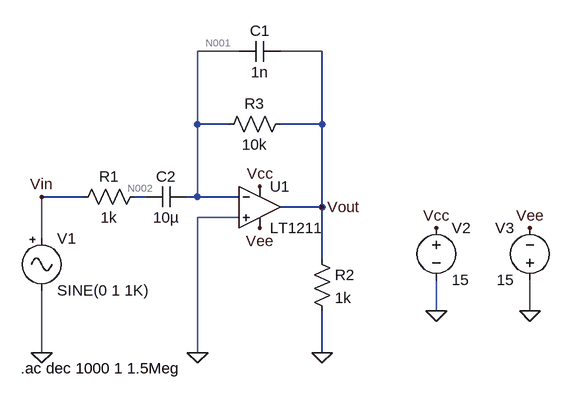
[diagram p0: schematic active_filter.asc]
active_filter.asc, the LTspice schematic file:
Version 4
SHEET 1 880 680
WIRE 336 -352 272 -352
WIRE 464 -352 400 -352
WIRE 272 -240 272 -352
WIRE 320 -240 272 -240
WIRE 464 -240 464 -352
WIRE 464 -240 400 -240
WIRE 96 -128 32 -128
WIRE 192 -128 176 -128
WIRE 272 -128 272 -240
WIRE 272 -128 256 -128
WIRE 336 -128 272 -128
WIRE 464 -112 464 -240
WIRE 464 -112 400 -112
WIRE 336 -96 272 -96
WIRE 32 -64 32 -128
WIRE 464 -32 464 -112
WIRE 640 48 640 0
WIRE 784 48 784 0
WIRE 32 112 32 16
WIRE 272 112 272 -96
WIRE 464 112 464 48
FLAG 32 112 0
FLAG 272 112 0
FLAG 464 112 0
FLAG 640 48 0
FLAG 784 48 0
FLAG 640 -80 Vcc
FLAG 368 -144 Vcc
FLAG 784 -80 Vee
FLAG 368 -80 Vee
FLAG 464 -112 Vout
FLAG 32 -128 Vin
SYMBOL res 192 -144 R90
WINDOW 0 0 56 VBottom 2
WINDOW 3 32 56 VTop 2
SYMATTR InstName R1
SYMATTR Value 1k
SYMBOL Misc\\signal 32 -80 R0
WINDOW 39 0 0 Left 0
SYMATTR InstName V1
SYMATTR Value2 AC 1
SYMBOL res 448 -48 R0
SYMATTR InstName R2
SYMATTR Value 1k
SYMBOL res 416 -256 R90
WINDOW 0 0 56 VBottom 2
WINDOW 3 32 56 VTop 2
SYMATTR InstName R3
SYMATTR Value 10k
SYMBOL cap 400 -368 R90
WINDOW 0 0 32 VBottom 2
WINDOW 3 32 32 VTop 2
SYMATTR InstName C1
SYMATTR Value 1n
SYMBOL voltage 640 -96 R0
WINDOW 123 0 0 Left 0
WINDOW 39 0 0 Left 0
SYMATTR InstName V2
SYMATTR Value 15
SYMBOL voltage 784 16 R180
WINDOW 0 24 96 Left 2
WINDOW 3 24 16 Left 2
WINDOW 123 0 0 Left 0
WINDOW 39 0 0 Left 0
SYMATTR InstName V3
SYMATTR Value 15
SYMBOL Opamps\\LT1211 368 -176 R0
SYMATTR InstName U1
SYMBOL cap 256 -144 R90
WINDOW 0 0 32 VBottom 2
WINDOW 3 32 32 VTop 2
SYMATTR InstName C2
SYMATTR Value 10µ
TEXT 0 136 Left 2 !.ac dec 1000 1 1.5Meg

The netlist it stands for:
* active_filter.asc
R1 N002 Vin 1k
V1 Vin 0 SINE(0 1 1K) AC 1
R2 Vout 0 1k
R3 Vout N001 10k
C1 Vout N001 1n
V2 Vcc 0 15
V3 0 Vee 15
XU1 0 N001 Vcc Vee Vout LT1211  ; pins In+ In- V+ V- OUT
C2 N001 N002 10µ
.ac dec 1000 1 1.5Meg
.lib LTC.lib
.backanno
.end

* Results of the author's LTspice run, read from the files saved beside the schematic
* Operating Point, zero values left out:
*   V(vout) = -500.2 µV
*   V(vcc) = 15 V
*   V(vee) = -15 V
*   I(R3) = -50.02 nA
*   I(R2) = -500.2 nA
*   I(V3) = -1.403 mA
*   I(V2) = -1.402 mA
*   Ix(u1:1) = -50.02 nA
*   Ix(u1:2) = -50.02 nA
*   Ix(u1:3) = 1.402 mA
*   Ix(u1:4) = -1.403 mA
*   Ix(u1:5) = 550.2 nA
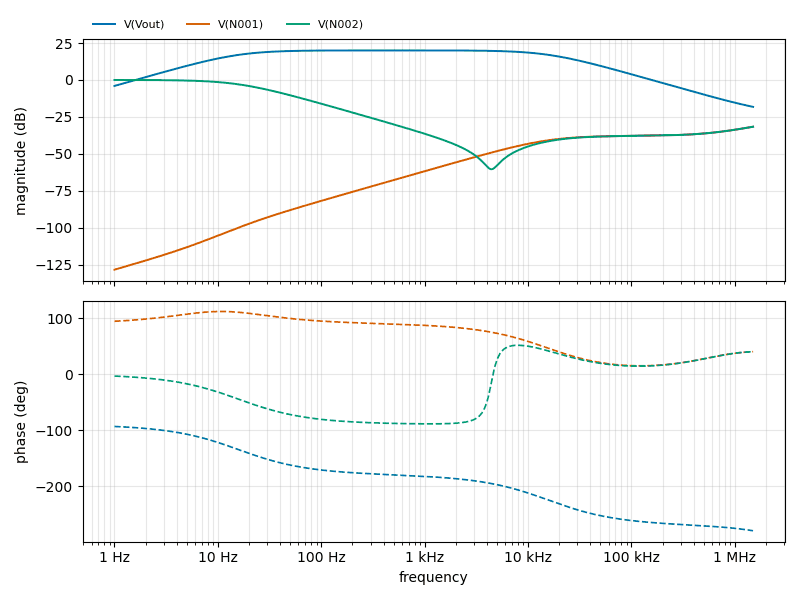
[diagram p1: AC Analysis of active_filter.asc, plotted from the saved traces]
* AC Analysis, 1 run:
*   V(Vout): -4.05 dB at 1 Hz, -18.22 dB at 1.5 MHz, peak 19.99 dB at 500 Hz, 3 dB below the peak at 15.88 Hz and 15.75 kHz
*   V(N001): -128.43 dB at 1 Hz, -31.66 dB at 1.5 MHz, peak -31.66 dB at 1.5 MHz, 3 dB below the peak at 803.7 kHz
*   V(N002): -0.02 dB at 1 Hz, -31.66 dB at 1.5 MHz, peak -0.02 dB at 1 Hz, 3 dB below the peak at 15.98 Hz